# Altium project MotorController.PrjPcb (part 1 of 2)
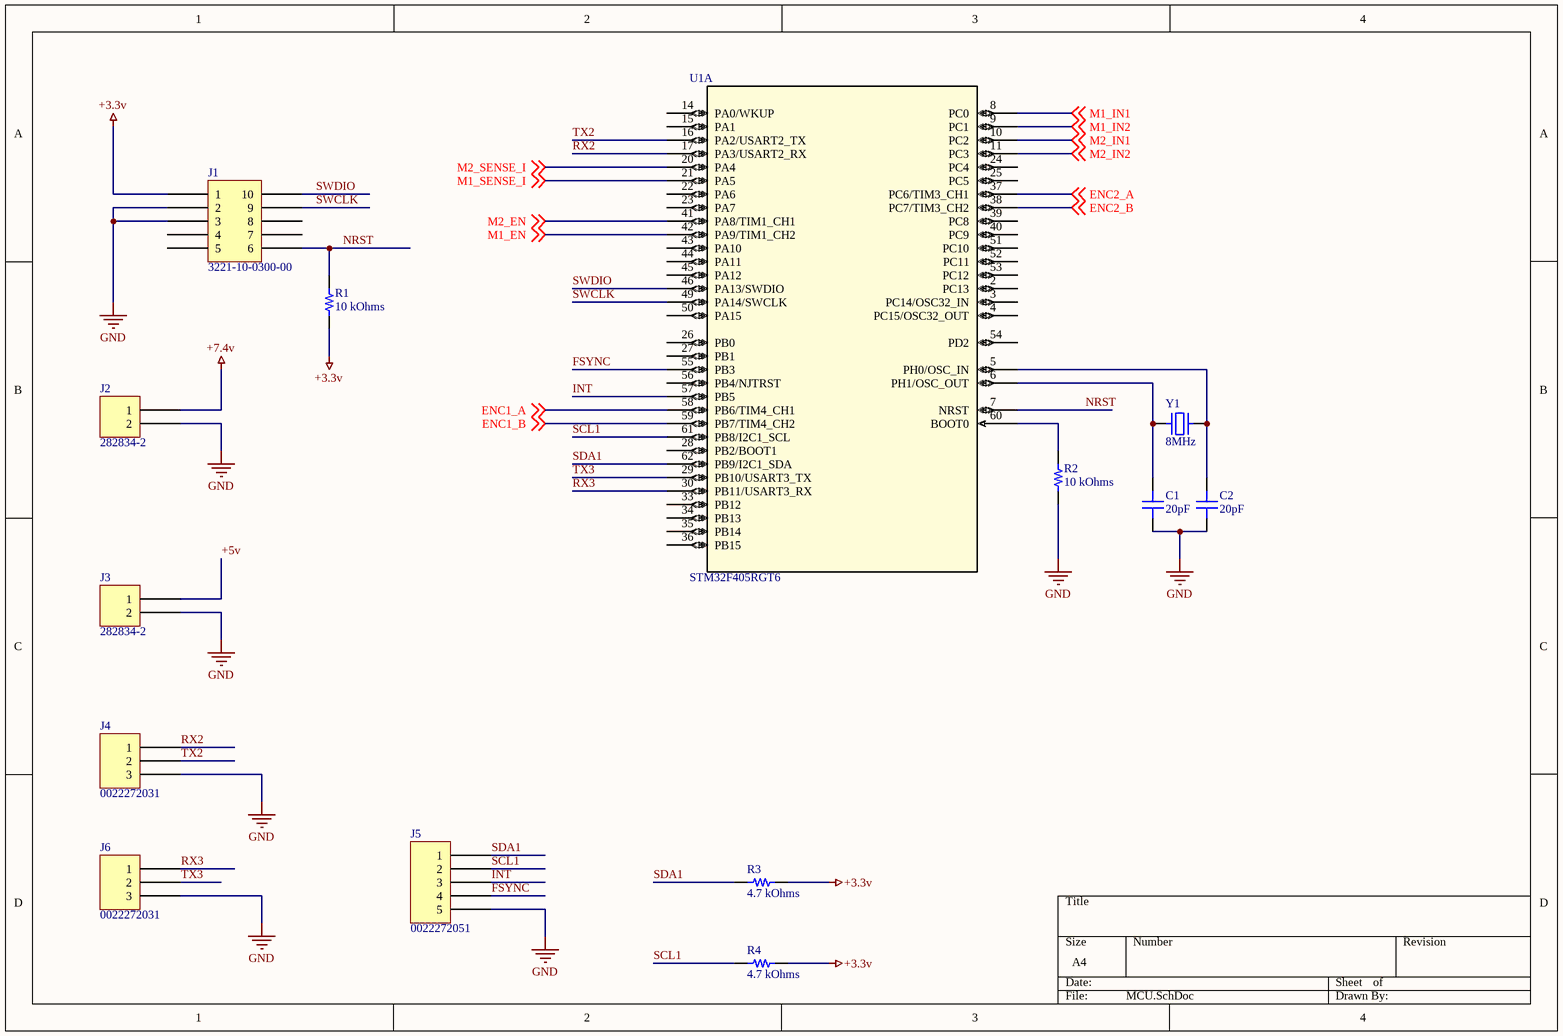
[diagram p0: MCU.SchDoc]
4 sheets, 80 parts. Net scope: global (net labels, ports and power ports of the same name join across sheets).
Board file: PCB1.PcbDoc
Sheets:
  MCU.SchDoc
  Power_12v.SchDoc
  MotorControl.SchDoc
  Power_5v.SchDoc

## Sheet MCU.SchDoc
size A4

### Parts
C1  20pF  [CAP 0805_2012]
C2  20pF  [CAP 0805_2012]
J1  3221-10-0300-00  [CNC TECH 3221-10-0300-00]
J2  282834-2  [TE 282834-2]
J3  282834-2  [TE 282834-2]
J4  0022272031  [MOLEX KK 0022272031]
J5  0022272051  [MOLEX KK 0022272051]
J6  0022272031  [MOLEX KK 0022272031]
R1  10 kOhms  [RES 0805_2012]
R2  10 kOhms  [RES 0805_2012]
R3  4.7 kOhms  [RES 0805_2012]
R4  4.7 kOhms  [RES 0805_2012]
U1  STM32F405RGT6  [LQFP64-10x10mm]  (part A of 2)
Y1  8MHz  [NDK NX5032GA]

### Nets
+3.3v: J1.1 R1.2 R3.2 R4.2
+5v: J3.1
+7.4v: J2.1
GND: C1.1 C2.1 J1.2 J1.3 J2.2 J3.2 J4.3 J5.5 J6.3 R2.1
ENC1_A: U1.58(PB6/TIM4_CH1) ; off-sheet ENC1_A
ENC1_B: U1.59(PB7/TIM4_CH2) ; off-sheet ENC1_B
ENC2_A: U1.37(PC6/TIM3_CH1) ; off-sheet ENC2_A
ENC2_B: U1.38(PC7/TIM3_CH2) ; off-sheet ENC2_B
FSYNC: J5.4 U1.55(PB3)
INT: J5.3 U1.57(PB5)
M1_EN: U1.42(PA9/TIM1_CH2) ; off-sheet M1_EN
M1_IN1: U1.8(PC0) ; off-sheet M1_IN1
M1_IN2: U1.9(PC1) ; off-sheet M1_IN2
M1_SENSE_I: U1.21(PA5) ; off-sheet M1_SENSE_I
M2_EN: U1.41(PA8/TIM1_CH1) ; off-sheet M2_EN
M2_IN1: U1.10(PC2) ; off-sheet M2_IN1
M2_IN2: U1.11(PC3) ; off-sheet M2_IN2
M2_SENSE_I: U1.20(PA4) ; off-sheet M2_SENSE_I
NRST: J1.6 R1.1 U1.7(NRST)
RX2: J4.1 U1.17(PA3/USART2_RX)
RX3: J6.1 U1.30(PB11/USART3_RX)
SCL1: J5.2 R4.1 U1.61(PB8/I2C1_SCL)
SDA1: J5.1 R3.1 U1.62(PB9/I2C1_SDA)
SWCLK: J1.9 U1.49(PA14/SWCLK)
SWDIO: J1.10 U1.46(PA13/SWDIO)
TX2: J4.2 U1.16(PA2/USART2_TX)
TX3: J6.2 U1.29(PB10/USART3_TX)
NetC1_2: C1.2 U1.6(PH1/OSC_OUT) Y1.1
NetC2_2: C2.2 U1.5(PH0/OSC_IN) Y1.2
NetR2_2: R2.2 U1.60(BOOT0)

Not connected (* = marked no-connect by the designer): J1 4 5 7 8; U1 2(PC13) 3(PC14/OSC32_IN) 4(PC15/OSC32_OUT) 14(PA0/WKUP) 15(PA1) 22(PA6) 23(PA7) 24(PC4) 25(PC5) 26(PB0) 27(PB1) 28(PB2/BOOT1) 33(PB12) 34(PB13) 35(PB14) 36(PB15) 39(PC8) 40(PC9) 43(PA10) 44(PA11) 45(PA12) 50(PA15) 51(PC10) 52(PC11) 53(PC12) 54(PD2) 56(PB4/NJTRST)

### Library data of the parts
C1 C2 = C0805C200J4GAC7800: CAP CER 20PF 16V C0G/NP0 0805; Manufacturer: KEMET; Temperature Coefficient: C0G, NP0; Tolerance: ±5%; Part Number: C0805C200J4GAC7800; Value: 20pF; Applications: General Purpose; Capacitance: 20pF; ComponentLink1Description: Datasheet; ComponentLink1URL: https://api.kemet.com/component-edge/download/datasheet/C0805C200J4GAC7800.pdf; ComponentLink2Description: DigiKey Link; ComponentLink2URL: http://digikey.com/product-detail/en/kemet/C0805C200J4GAC7800/399-9987-1-ND/3736986; Device Package: 0805 (2012 Metric); Features: Low ESL; LastUpdated: 9/2/2020 1:04:36 AM; Lifecycle Status: Active; Minimum Order: 1; Mounting Type: Surface Mount, MLCC; Operating Temperature: -55°C ~ 125°C; Package / Case: 0805 (2012 Metric); Packaging: TapeAndReel; PartId: 5865; Part Status: Active; Price: 0.06; Series: SMD Comm C0G; Size / Dimension: 0.079" L x 0.049" W (2.00mm x 1.25mm); Supplier 1: DigiKey; Supplier Part Number 1: 399-9987-1-ND; Thickness (Max): 0.035" (0.88mm); Voltage - Rated: 16V
J1 = 3221-10-0300-00: CONN HEADER SMD 10POS 1.27MM; Manufacturer: CNC Tech; Current Rating (Amps): 1A; Material Flammability Rating: UL94 V-0; Number of Positions: 10; Number of Positions Loaded: All; Pitch - Mating: 0.050" (1.27mm); Shrouding: Shrouded - 4 Wall; Style: Board to Cable/Wire; Part Number: 3221-10-0300-00; ComponentLink1Description: Datasheet; ComponentLink1URL: http://cnctech.us/idcmatching2.pdf; ComponentLink2Description: DigiKey Link; ComponentLink2URL: http://digikey.com/product-detail/en/cnc-tech/3221-10-0300-00/1175-1735-ND/4878946; Connector Type: Header; Contact Finish - Mating: Gold; Contact Finish - Post: Gold; Contact Finish Thickness - Mating: Flash; Contact Material: Brass; Contact Shape: Square; Contact Type: Male Pin; Fastening Type: Push-Pull; Features: Keying Slot; Insulation Height: 0.213" (5.40mm); Insulation Material: Polyamide (PA6T), Nylon 6T; LastUpdated: 1/13/2020 12:09:21 AM; Lifecycle Status: Active; Minimum Order: 1; Mounting Type: Surface Mount; Number of Rows: 2; Operating Temperature: -40°C ~ 105°C; Packaging: Tray; PartId: 109; Part Status: Active; Price: 0.73; Row Spacing - Mating: 0.050" (1.27mm); Series: -; Supplier 1: DigiKey; Supplier Part Number 1: 1175-1735-ND; Termination: Solder
J2 J3 = 282834-2: TERM BLK 2P SIDE ENT 2.54MM PCB; Manufacturer: TE Connectivity AMP Connectors; Current: 10A; Mating Orientation: Horizontal with Board; Number of Levels: 1; Pitch: 0.100" (2.54mm); Positions Per Level: 2; Voltage: 150V; Wire Gauge: 16-30 AWG; Wire Termination: Screw - Rising Cage Clamp; Part Number: 282834-2; Color: Green; ComponentLink1Description: Datasheet; ComponentLink1URL: https://www.te.com/commerce/DocumentDelivery/DDEController?Action=srchrtrv&DocNm=282834&DocType=Customer+Drawing&DocLang=English; ComponentLink2Description: DigiKey Link; ComponentLink2URL: http://digikey.com/product-detail/en/te-connectivity-amp-connectors/282834-2/A98333-ND/1150135; LastUpdated: 1/15/2020 4:15:38 AM; Lifecycle Status: Active; Minimum Order: 1; Mounting Type: Through Hole; Packaging: Bulk; Part Status: Active; Price: 0.88; Series: Buchanan; Supplier 1: DigiKey; Supplier Part Number 1: A98333-ND
J4 J6 = 0022272031: CONN HEADER VERT 3POS 2.54MM; Manufacturer: Molex; Contact Length - Mating: 0.295" (7.49mm); Contact Length - Post: 0.140" (3.56mm); Material Flammability Rating: UL94 V-0; Number of Positions: 3; Number of Positions Loaded: All; Overall Contact Length: 0.560" (14.22mm); Pitch - Mating: 0.100" (2.54mm); Shrouding: Shrouded - 1 Wall; Style: Board to Cable/Wire; Part Number: 0022272031; ComponentLink1Description: Datasheet; ComponentLink1URL: https://www.molex.com/pdm_docs/sd/022272031_sd.pdf; ComponentLink2Description: DigiKey Link; ComponentLink2URL: http://digikey.com/product-detail/en/molex/0022272031/WM4112-ND/1130578; Connector Type: Header; Contact Finish - Mating: Tin; Contact Finish - Post: Tin; Contact Finish Thickness - Mating: 100.0µin (2.54µm); Contact Material: Brass; Contact Shape: Square; Contact Type: Male Pin; Fastening Type: Friction Lock; Insulation Color: Natural; Insulation Height: 0.461" (11.70mm); Insulation Material: Polyamide (PA), Nylon; LastUpdated: 1/12/2020 11:51:54 PM; Lifecycle Status: Active; Minimum Order: 1; Mounting Type: Through Hole; Number of Rows: 1; Packaging: Bulk; PartId: 77; Part Status: Active; Price: 0.37; Series: KK 6410; Supplier 1: DigiKey; Supplier Part Number 1: WM4112-ND; Termination: Solder
J5 = 0022272051: CONN HEADER VERT 5POS 2.54MM; Manufacturer: Molex; Contact Length - Mating: 0.295" (7.49mm); Contact Length - Post: 0.140" (3.56mm); Material Flammability Rating: UL94 V-0; Number of Positions: 5; Number of Positions Loaded: All; Overall Contact Length: 0.560" (14.22mm); Pitch - Mating: 0.100" (2.54mm); Shrouding: Shrouded - 1 Wall; Style: Board to Cable/Wire; Part Number: 0022272051; ComponentLink1Description: Datasheet; ComponentLink1URL: https://www.molex.com/pdm_docs/sd/022272051_sd.pdf; ComponentLink2Description: DigiKey Link; ComponentLink2URL: http://digikey.com/product-detail/en/molex/0022272051/WM4114-ND/1130580; Connector Type: Header; Contact Finish - Mating: Tin; Contact Finish - Post: Tin; Contact Finish Thickness - Mating: 100.0µin (2.54µm); Contact Material: Brass; Contact Shape: Square; Contact Type: Male Pin; Fastening Type: Friction Lock; Insulation Color: Natural; Insulation Height: 0.461" (11.70mm); Insulation Material: Polyamide (PA), Nylon; LastUpdated: 1/12/2020 11:52:16 PM; Lifecycle Status: Active; Minimum Order: 1; Mounting Type: Through Hole; Number of Rows: 1; Packaging: Bulk; PartId: 79; Part Status: Active; Price: 0.46; Series: KK 6410; Supplier 1: DigiKey; Supplier Part Number 1: WM4114-ND; Termination: Solder
R1 = RMCS0805JT10K0: RES 10K OHM 5% 1/8W 0805; Manufacturer: Stackpole Electronics Inc; Power (Watts): 0.125W, 1/8W; Temperature Coefficient: ±100ppm/°C; Part Number: RMCS0805JT10K0; Value: 10 kOhms; ComponentLink1Description: Datasheet; ComponentLink1URL: https://www.seielect.com/catalog/sei-rmcs.pdf; ComponentLink2Description: DigiKey Link; ComponentLink2URL: http://digikey.com/product-detail/en/stackpole-electronics-inc/RMCS0805JT10K0/RMCS0805JT10K0CT-ND/9770325; Composition: Thick Film; Device Package: 0805 (2012 Metric); Features: Anti-Sulfur; Height - Seated (Max): 0.024" (0.60mm); LastUpdated: 9/2/2020 1:14:40 AM; Lifecycle Status: Active; Minimum Order: 1; Number of Terminations: 2; Operating Temperature: -55°C ~ 155°C; Package / Case: 0805 (2012 Metric); Packaging: TapeAndReel; PartId: 46907; Part Status: Active; Price: 0.01; Resistance: 10 kOhms; Series: RMCS; Size / Dimension: 0.079" L x 0.049" W (2.00mm x 1.25mm); Supplier 1: DigiKey; Supplier Part Number 1: RMCS0805JT10K0CT-ND; Supplier Device Package: 0805; Tolerance: ±5%
R2 = RC0805JR-0710KL: RES SMD 10K OHM 5% 1/8W 0805; Manufacturer: Yageo; Power (Watts): 0.125W, 1/8W; Temperature Coefficient: ±100ppm/°C; Part Number: RC0805JR-0710KL; Value: 10 kOhms; ComponentLink1Description: Datasheet; ComponentLink1URL: https://www.yageo.com/upload/media/product/productsearch/datasheet/rchip/PYu-RC_Group_51_RoHS_L_10.pdf; ComponentLink2Description: DigiKey Link; ComponentLink2URL: http://digikey.com/product-detail/en/yageo/RC0805JR-0710KL/311-10KARCT-ND/731188; Composition: Thick Film; Device Package: 0805 (2012 Metric); Features: Moisture Resistant; Height - Seated (Max): 0.024" (0.60mm); LastUpdated: 9/2/2020 1:15:00 AM; Lifecycle Status: Active; Minimum Order: 1; Number of Terminations: 2; Operating Temperature: -55°C ~ 155°C; Package / Case: 0805 (2012 Metric); Packaging: CutTape; PartId: 38737; Part Status: Active; Price: 0.10; Resistance: 10 kOhms; Series: RC; Size / Dimension: 0.079" L x 0.049" W (2.00mm x 1.25mm); Supplier 1: DigiKey; Supplier Part Number 1: 311-10KARCT-ND; Supplier Device Package: 0805; Tolerance: ±5%
R3 R4 = CRCW08054K70JNTA: RES SMD 4.7K OHM 5% 1/8W 0805; Manufacturer: Vishay Dale; Power (Watts): 0.125W, 1/8W; Temperature Coefficient: ±200ppm/°C; Part Number: CRCW08054K70JNTA; Value: 4.7 kOhms; ComponentLink1Description: Datasheet; ComponentLink1URL: http://www.vishay.com/docs/20008/dcrcw.pdf; ComponentLink2Description: DigiKey Link; ComponentLink2URL: http://digikey.com/product-detail/en/vishay-dale/CRCW08054K70JNTA/541-3029-1-ND/6073672; Composition: Thick Film; Device Package: 0805 (2012 Metric); Features: Automotive AEC-Q200; Height - Seated (Max): 0.020" (0.50mm); LastUpdated: 9/2/2020 1:15:17 AM; Lifecycle Status: Active; Minimum Order: 1; Number of Terminations: 2; Operating Temperature: -55°C ~ 155°C; Package / Case: 0805 (2012 Metric); Packaging: TapeAndReel; PartId: 30842; Part Status: Active; Price: 0.01; Ratings: AEC-Q200; Resistance: 4.7 kOhms; Series: CRCW; Size / Dimension: 0.079" L x 0.049" W (2.00mm x 1.25mm); Supplier 1: DigiKey; Supplier Part Number 1: 541-3029-1-ND; Supplier Device Package: 0805; Tolerance: ±5%
U1 = STM32F405RGT6: No Description Available; Vendor: STMicroelectronics; Built_By: EMA_UL_Team; SourceLibrary: Updates_to_database_2020-10-19; Manufacturer_Part_Number: STM32F405RGT6; Copyright: Copyright (C) 2018 Accelerated Designs. All rights reserved; RefDes: RefDes; Type: DEV
Y1 = NX5032GA-8MHZ-EXS00A-CG07039: CRYSTAL 8MHZ 18PF SMD; Manufacturer: NDK America, Inc.; ESR (Equivalent Series Resistance): 300 Ohms; Frequency Stability: ±30ppm; Frequency Tolerance: ±20ppm; Operating Mode: Fundamental; Part Number: NX5032GA-8MHZ-EXS00A-CG07039; ComponentLink1Description: Datasheet; ComponentLink1URL: //media.digikey.com/pdf/Data%20Sheets/NDK%20PDFs/NX5032GA-8MHz-EXS00A-CG07039.pdf; ComponentLink2Description: DigiKey Link; ComponentLink2URL: http://digikey.com/product-detail/en/ndk-america-inc/NX5032GA-8MHZ-EXS00A-CG07039/644-1318-1-ND/8275436; Frequency: 8MHz; Height - Seated (Max): 0.059" (1.50mm); LastUpdated: 02.09.2020 1:22:00; Lifecycle Status: Active; Load Capacitance: 18pF; Minimum Order: 1; Mounting Type: Surface Mount; Operating Temperature: -40°C ~ 85°C; Package / Case: 2-SMD, No Lead; Packaging: TapeAndReel; PartId: 609; Part Status: Active; Price: 0.37; Series: NX5032GA; Size / Dimension: 0.197" L x 0.126" W (5.00mm x 3.20mm); Supplier 1: DigiKey; Supplier Part Number 1: 644-1318-1-ND; Type: MHz Crystal; Value: 8MHz

## Sheet Power_12v.SchDoc
size A
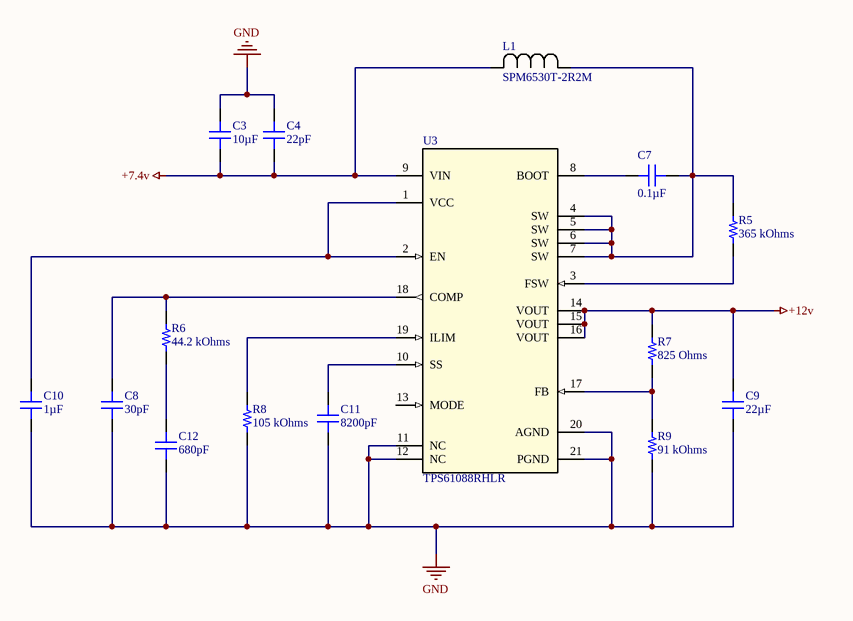
[diagram p1: Power_12v.SchDoc]

### Parts
C3  10µF  [CAP 1210_3225 - 2.8MM]
C4  22pF  [CAP 0603_1608]
C7  0.1µF  [CAP 0603_1608]
C8  value 30pF  [CAP 0603_1608]  (hidden comment: 22pF)
C9  22µF  [CAP 1210_3225 - 2.8MM]
C10  1µF  [CAP 0603_1608]
C11  value 8200pF  [CAP 0603_1608]  (hidden comment: 1µF)
C12  value 680pF  [CAP 0603_1608]  (hidden comment: 470pF)
L1  SPM6530T-2R2M  [IND_SPM6530_TDK]
R5  value 365 kOhms  [RES 0603_1608]  (hidden comment: 267 kOhms)
R6  value 44.2 kOhms  [RES 0603_1608]  (hidden comment: 36.5 kOhms)
R7  value 825 Ohms  [RES 0603_1608]  (hidden comment: 267 kOhms)
R8  105 kOhms  [RES 0603_1608]
R9  value 91 kOhms  [RES 0805_2012]  (hidden comment: 392 kOhms)
U3  TPS61088RHLR  [RHL0020A]

### Nets
+7.4v: C3.1 C4.1 L1.2 U3.9(VIN)
+12v: C9.2 R7.2 U3.14(VOUT) U3.15(VOUT) U3.16(VOUT)
GND: C3.2 C4.2 C8.1 C9.1 C10.1 C11.1 C12.1 R8.1 R9.2 U3.11(NC) U3.12(NC) U3.20(AGND) U3.21(PGND)
NetC7_1: C7.1 U3.8(BOOT)
NetC7_2: C7.2 L1.1 R5.2 U3.4(SW) U3.5(SW) U3.6(SW) U3.7(SW)
NetC8_2: C8.2 R6.2 U3.18(COMP)
NetC10_2: C10.2 U3.1(VCC) U3.2(EN)
NetC11_2: C11.2 U3.10(SS)
NetC12_2: C12.2 R6.1
NetR5_1: R5.1 U3.3(FSW)
NetR7_1: R7.1 R9.1 U3.17(FB)
NetR8_2: R8.2 U3.19(ILIM)

Not connected (* = marked no-connect by the designer): U3 13(MODE)

### Library data of the parts
C3 = GCJ32EC71H106KA01L: CAP CER 10UF 50V X7S 1210; Manufacturer: Murata Electronics; Tolerance: ±10%; Part Number: GCJ32EC71H106KA01L; Value: 10µF; Applications: Automotive, Boardflex Sensitive; Capacitance: 10µF; ComponentLink1Description: Datasheet; ComponentLink1URL: https://search.murata.co.jp/Ceramy/image/img/A01X/G101/ENG/GCJ32EC71H106KA01-01.pdf; ComponentLink2Description: DigiKey Link; ComponentLink2URL: http://digikey.com/product-detail/en/murata-electronics/GCJ32EC71H106KA01L/490-14418-1-ND/6606879; Device Package: 1210 (3225 Metric); Features: Soft Termination; LastUpdated: 9/2/2020 1:10:53 AM; Lifecycle Status: Active; Minimum Order: 1; Mounting Type: Surface Mount, MLCC; Operating Temperature: -55°C ~ 125°C; Package / Case: 1210 (3225 Metric); Packaging: TapeAndReel; PartId: 23622; Part Status: Active; Price: 0.53; Ratings: AEC-Q200; Series: GCJ; Size / Dimension: 0.126" L x 0.098" W (3.20mm x 2.50mm); Supplier 1: DigiKey; Supplier Part Number 1: 490-14418-1-ND; Temperature Coefficient: X7S; Thickness (Max): 0.110" (2.80mm); Voltage - Rated: 50V
C4 = 06033A220KAT2A: CAP CER 22PF 25V C0G/NP0 0603; Manufacturer: AVX Corporation; Temperature Coefficient: C0G, NP0; Tolerance: ±10%; Part Number: 06033A220KAT2A; Value: 22pF; Applications: General Purpose; Capacitance: 22pF; ComponentLink1Description: Datasheet; ComponentLink1URL: http://datasheets.avx.com/C0GNP0-Dielectric.pdf; ComponentLink2Description: DigiKey Link; ComponentLink2URL: http://digikey.com/product-detail/en/avx-corporation/06033A220KAT2A/478-11803-1-ND/8573439; Device Package: 0603 (1608 Metric); LastUpdated: 9/2/2020 1:03:34 AM; Lifecycle Status: Active; Minimum Order: 1; Mounting Type: Surface Mount, MLCC; Operating Temperature: -55°C ~ 125°C; Package / Case: 0603 (1608 Metric); Packaging: TapeAndReel; PartId: 3017; Part Status: Active; Price: 0.04; Series: -; Size / Dimension: 0.063" L x 0.032" W (1.60mm x 0.81mm); Supplier 1: DigiKey; Supplier Part Number 1: 478-11803-1-ND; Thickness (Max): 0.035" (0.90mm); Voltage - Rated: 25V
C7 = 0603YC104JAT4A: CAP CER 0.1UF 16V X7R 0603; Manufacturer: AVX Corporation; Tolerance: ±5%; Part Number: 0603YC104JAT4A; Value: 0.1µF; Applications: General Purpose; Capacitance: 0.1µF; ComponentLink1Description: Datasheet; ComponentLink1URL: http://datasheets.avx.com/X7RDielectric.pdf; ComponentLink2Description: DigiKey Link; ComponentLink2URL: http://digikey.com/product-detail/en/avx-corporation/0603YC104JAT4A/478-7621-1-ND/7536239; Device Package: 0603 (1608 Metric); LastUpdated: 9/2/2020 1:03:19 AM; Lifecycle Status: Active; Minimum Order: 1; Mounting Type: Surface Mount, MLCC; Operating Temperature: -55°C ~ 125°C; Package / Case: 0603 (1608 Metric); Packaging: TapeAndReel; PartId: 11638; Part Status: Active; Price: 0.03; Series: -; Size / Dimension: 0.063" L x 0.032" W (1.60mm x 0.81mm); Supplier 1: DigiKey; Supplier Part Number 1: 478-7621-1-ND; Temperature Coefficient: X7R; Thickness (Max): 0.035" (0.90mm); Voltage - Rated: 16V
C8 = C0805C300J5GACTU: CAP CER 30PF 50V C0G/NP0 0805; Manufacturer: KEMET; Temperature Coefficient: C0G, NP0; Tolerance: ±5%; Part Number: C0805C300J5GACTU; Applications: General Purpose; Capacitance: 30pF; ComponentLink1Description: Datasheet; ComponentLink1URL: https://api.kemet.com/component-edge/download/datasheet/C0805C300J5GACTU.pdf; ComponentLink2Description: DigiKey Link; ComponentLink2URL: http://digikey.com/product-detail/en/kemet/C0805C300J5GACTU/399-9219-1-ND/3522737; Device Package: 0805 (2012 Metric); Features: Low ESL; LastUpdated: 9/2/2020 1:04:20 AM; Lifecycle Status: Active; Minimum Order: 1; Mounting Type: Surface Mount, MLCC; Operating Temperature: -55°C ~ 125°C; Package / Case: 0805 (2012 Metric); Packaging: TapeAndReel; PartId: 14047; Part Status: Active; Price: 0.06; Series: SMD Comm C0G; Size / Dimension: 0.079" L x 0.049" W (2.00mm x 1.25mm); Supplier 1: DigiKey; Supplier Part Number 1: 399-9219-1-ND; Thickness (Max): 0.035" (0.88mm); Voltage - Rated: 50V
C9 = GRM32ER71E226ME15K: CAP CER 22UF 25V X7R 1210; Manufacturer: Murata Electronics; Tolerance: ±20%; Part Number: GRM32ER71E226ME15K; Value: 22µF; Applications: General Purpose; Capacitance: 22µF; ComponentLink1Description: Datasheet; ComponentLink1URL: https://search.murata.co.jp/Ceramy/image/img/A01X/G101/ENG/GRM32ER71E226ME15-01.pdf; ComponentLink2Description: DigiKey Link; ComponentLink2URL: http://digikey.com/product-detail/en/murata-electronics/GRM32ER71E226ME15K/490-14682-1-ND/6606288; Device Package: 1210 (3225 Metric); LastUpdated: 9/2/2020 1:10:50 AM; Lifecycle Status: Active; Minimum Order: 1; Mounting Type: Surface Mount, MLCC; Operating Temperature: -55°C ~ 125°C; Package / Case: 1210 (3225 Metric); Packaging: TapeAndReel; PartId: 24019; Part Status: Active; Price: 0.35; Series: GRM; Size / Dimension: 0.126" L x 0.098" W (3.20mm x 2.50mm); Supplier 1: DigiKey; Supplier Part Number 1: 490-14682-1-ND; Temperature Coefficient: X7R; Thickness (Max): 0.106" (2.70mm); Voltage - Rated: 25V
C10 = C0603C105K4PACTU: CAP CER 1UF 16V X5R 0603; Manufacturer: KEMET; Tolerance: ±10%; Part Number: C0603C105K4PACTU; Value: 1µF; Applications: General Purpose; Capacitance: 1µF; ComponentLink1Description: Datasheet; ComponentLink1URL: https://api.kemet.com/component-edge/download/datasheet/C0603C105K4PACTU.pdf; ComponentLink2Description: DigiKey Link; ComponentLink2URL: http://digikey.com/product-detail/en/kemet/C0603C105K4PACTU/399-5090-1-ND/1465624; Device Package: 0603 (1608 Metric); LastUpdated: 9/2/2020 1:03:33 AM; Lifecycle Status: Active; Minimum Order: 1; Mounting Type: Surface Mount, MLCC; Operating Temperature: -55°C ~ 85°C; Package / Case: 0603 (1608 Metric); Packaging: TapeAndReel; PartId: 3768; Part Status: Active; Price: 0.02; Series: SMD Comm X5R; Size / Dimension: 0.063" L x 0.031" W (1.60mm x 0.80mm); Supplier 1: DigiKey; Supplier Part Number 1: 399-5090-1-ND; Temperature Coefficient: X5R; Thickness (Max): 0.035" (0.90mm); Voltage - Rated: 16V
C11 = CDR31BX822AKUS7185: CAP CER 8200PF 50V BX 0805; Manufacturer: KEMET; Tolerance: ±10%; Part Number: CDR31BX822AKUS7185; Applications: High Reliability; Capacitance: 8200pF; ComponentLink1Description: Datasheet; ComponentLink1URL: https://content.kemet.com/datasheets/F3102_MIL-PRF-55681.pdf; ComponentLink2Description: DigiKey Link; ComponentLink2URL: http://digikey.com/product-detail/en/kemet/CDR31BX822AKUS7185/1001-2399-1-ND/3738615; Device Package: 0805 (2012 Metric); Failure Rate: S (0.001%); LastUpdated: 9/2/2020 1:04:33 AM; Lifecycle Status: Active; Minimum Order: 1; Mounting Type: Surface Mount, MLCC; Operating Temperature: -55°C ~ 125°C; Package / Case: 0805 (2012 Metric); Packaging: TapeAndReel; PartId: 7255; Part Status: Active; Price: 0.86; Series: Military, MIL-PRF-55681, CDR31; Size / Dimension: 0.079" L x 0.049" W (2.00mm x 1.25mm); Supplier 1: DigiKey; Supplier Part Number 1: 1001-2399-1-ND; Temperature Coefficient: BX; Thickness (Max): 0.051" (1.30mm); Voltage - Rated: 50V
C12 = CC0805JRNPO9BN681: CAP CER 680PF 50V C0G/NPO 0805; Manufacturer: Yageo; Temperature Coefficient: C0G, NP0; Tolerance: ±5%; Part Number: CC0805JRNPO9BN681; Applications: General Purpose; Capacitance: 680pF; ComponentLink1Description: Datasheet; ComponentLink1URL: https://www.yageo.com/upload/media/product/productsearch/datasheet/mlcc/UPY-GP_NP0_16V-to-50V_17.pdf; ComponentLink2Description: DigiKey Link; ComponentLink2URL: http://digikey.com/product-detail/en/yageo/CC0805JRNPO9BN681/311-1121-1-ND/303031; Device Package: 0805 (2012 Metric); Features: High Voltage; LastUpdated: 9/2/2020 1:04:42 AM; Lifecycle Status: Active; Minimum Order: 1; Mounting Type: Surface Mount, MLCC; Operating Temperature: -55°C ~ 125°C; Package / Case: 0805 (2012 Metric); Packaging: TapeAndReel; PartId: 2491; Part Status: Active; Price: 0.02; Series: CC; Size / Dimension: 0.079" L x 0.049" W (2.00mm x 1.25mm); Supplier 1: DigiKey; Supplier Part Number 1: 311-1121-1-ND; Thickness (Max): 0.024" (0.60mm); Voltage - Rated: 50V
L1 = SPM6530T-2R2M: No Description Available; Vendor: TDK; Built_By: EMA_UL_Team; SourceLibrary: TDK_2015_05_22; Manufacturer_Part_Number: SPM6530T-2R2M; Copyright: Copyright (C) 2018 Accelerated Designs. All rights reserved
R5 = RC0805FR-07365KL: RES SMD 365K OHM 1% 1/8W 0805; Manufacturer: Yageo; Power (Watts): 0.125W, 1/8W; Temperature Coefficient: ±100ppm/°C; Part Number: RC0805FR-07365KL; ComponentLink1Description: Datasheet; ComponentLink1URL: https://www.yageo.com/upload/media/product/productsearch/datasheet/rchip/PYu-RC_Group_51_RoHS_L_10.pdf; ComponentLink2Description: DigiKey Link; ComponentLink2URL: http://digikey.com/product-detail/en/yageo/RC0805FR-07365KL/311-365KCRCT-ND/730836; Composition: Thick Film; Device Package: 0805 (2012 Metric); Features: Moisture Resistant; Height - Seated (Max): 0.024" (0.60mm); LastUpdated: 9/2/2020 1:14:46 AM; Lifecycle Status: Active; Minimum Order: 1; Number of Terminations: 2; Operating Temperature: -55°C ~ 155°C; Package / Case: 0805 (2012 Metric); Packaging: CutTape; PartId: 45039; Part Status: Active; Price: 0.10; Resistance: 365 kOhms; Series: RC; Size / Dimension: 0.079" L x 0.049" W (2.00mm x 1.25mm); Supplier 1: DigiKey; Supplier Part Number 1: 311-365KCRCT-ND; Supplier Device Package: 0805; Tolerance: ±1%
R6 = KTR10EZPF4422: RES SMD 44.2K OHM 1% 1/8W 0805; Manufacturer: Rohm Semiconductor; Power (Watts): 0.125W, 1/8W; Temperature Coefficient: ±100ppm/°C; Part Number: KTR10EZPF4422; ComponentLink1Description: Datasheet; ComponentLink1URL: https://www.rohm.com/datasheet/KTR03EZPF/ktr-e; ComponentLink2Description: DigiKey Link; ComponentLink2URL: http://digikey.com/product-detail/en/rohm-semiconductor/KTR10EZPF4422/RHM44.2KAHCT-ND/4054582; Composition: Thick Film; Device Package: 0805 (2012 Metric); Features: Automotive AEC-Q200, High Voltage; Height - Seated (Max): 0.026" (0.65mm); LastUpdated: 9/2/2020 1:15:21 AM; Lifecycle Status: Active; Minimum Order: 1; Number of Terminations: 2; Operating Temperature: -55°C ~ 155°C; Package / Case: 0805 (2012 Metric); Packaging: TapeAndReel; PartId: 29064; Part Status: Active; Price: 0.02; Ratings: AEC-Q200; Resistance: 44.2 kOhms; Series: KTR; Size / Dimension: 0.079" L x 0.049" W (2.00mm x 1.25mm); Supplier 1: DigiKey; Supplier Part Number 1: RHM44.2KAHCT-ND; Supplier Device Package: 0805; Tolerance: ±1%
R7 = RMCF0805FT825R: RES 825 OHM 1% 1/8W 0805; Manufacturer: Stackpole Electronics Inc; Power (Watts): 0.125W, 1/8W; Temperature Coefficient: ±100ppm/°C; Part Number: RMCF0805FT825R; ComponentLink1Description: Datasheet; ComponentLink1URL: https://www.seielect.com/catalog/sei-rmcf_rmcp.pdf; ComponentLink2Description: DigiKey Link; ComponentLink2URL: http://digikey.com/product-detail/en/stackpole-electronics-inc/RMCF0805FT825R/RMCF0805FT825RCT-ND/1942368; Composition: Thick Film; Device Package: 0805 (2012 Metric); Features: Automotive AEC-Q200; Height - Seated (Max): 0.026" (0.65mm); LastUpdated: 9/2/2020 1:14:59 AM; Lifecycle Status: Active; Minimum Order: 1; Number of Terminations: 2; Operating Temperature: -55°C ~ 155°C; Package / Case: 0805 (2012 Metric); Packaging: CutTape; PartId: 38939; Part Status: Active; Price: 0.10; Ratings: AEC-Q200; Resistance: 825 Ohms; Series: RMCF; Size / Dimension: 0.079" L x 0.049" W (2.00mm x 1.25mm); Supplier 1: DigiKey; Supplier Part Number 1: RMCF0805FT825RCT-ND; Supplier Device Package: 0805; Tolerance: ±1%
R8 = RC0603FR-07105KL: RES SMD 105K OHM 1% 1/10W 0603; Manufacturer: Yageo; Power (Watts): 0.1W, 1/10W; Temperature Coefficient: ±100ppm/°C; Part Number: RC0603FR-07105KL; Value: 105 kOhms; ComponentLink1Description: Datasheet; ComponentLink1URL: https://www.yageo.com/upload/media/product/productsearch/datasheet/rchip/PYu-RC_Group_51_RoHS_L_10.pdf; ComponentLink2Description: DigiKey Link; ComponentLink2URL: http://digikey.com/product-detail/en/yageo/RC0603FR-07105KL/311-105KHRCT-ND/729840; Composition: Thick Film; Device Package: 0603 (1608 Metric); Features: Moisture Resistant; Height - Seated (Max): 0.022" (0.55mm); LastUpdated: 9/2/2020 1:10:19 AM; Lifecycle Status: Active; Minimum Order: 1; Number of Terminations: 2; Operating Temperature: -55°C ~ 155°C; Package / Case: 0603 (1608 Metric); Packaging: CutTape; PartId: 7511; Part Status: Active; Price: 0.10; Resistance: 105 kOhms; Series: RC; Size / Dimension: 0.063" L x 0.031" W (1.60mm x 0.80mm); Supplier 1: DigiKey; Supplier Part Number 1: 311-105KHRCT-ND; Supplier Device Package: 0603; Tolerance: ±1%
R9 = CRCW080591K0JNEA: RES SMD 91K OHM 5% 1/8W 0805; Manufacturer: Vishay Dale; Power (Watts): 0.125W, 1/8W; Temperature Coefficient: ±200ppm/°C; Part Number: CRCW080591K0JNEA; ComponentLink1Description: Datasheet; ComponentLink1URL: http://www.vishay.com/docs/20035/dcrcwe3.pdf; ComponentLink2Description: DigiKey Link; ComponentLink2URL: http://digikey.com/product-detail/en/vishay-dale/CRCW080591K0JNEA/541-91KACT-ND/1180387; Composition: Thick Film; Device Package: 0805 (2012 Metric); Features: Automotive AEC-Q200; Height - Seated (Max): 0.020" (0.50mm); LastUpdated: 9/2/2020 1:14:34 AM; Lifecycle Status: Active; Minimum Order: 1; Number of Terminations: 2; Operating Temperature: -55°C ~ 155°C; Package / Case: 0805 (2012 Metric); Packaging: CutTape; PartId: 48020; Part Status: Active; Price: 0.10; Ratings: AEC-Q200; Resistance: 91 kOhms; Series: CRCW; Size / Dimension: 0.079" L x 0.049" W (2.00mm x 1.25mm); Supplier 1: DigiKey; Supplier Part Number 1: 541-91KACT-ND; Supplier Device Package: 0805; Tolerance: ±5%
U3 = TPS61088RHLR: No Description Available; Alternate_PartNumber: TPS61088RHLT; Manufacturer: Texas Instruments; CompType: IC; PIN_COUNT: 21; Application_BuildNumber: *; PartNumber: TPS61088RHLR; PackageReference: RHL0020A; MountType: SMT; RoHS: Y; RefDes: RefDes; Type: DEV; Value: Value; Copyright: Copyright (C) 2018 Accelerated Designs. All rights reserved

## Sheet MotorControl.SchDoc
size Letter
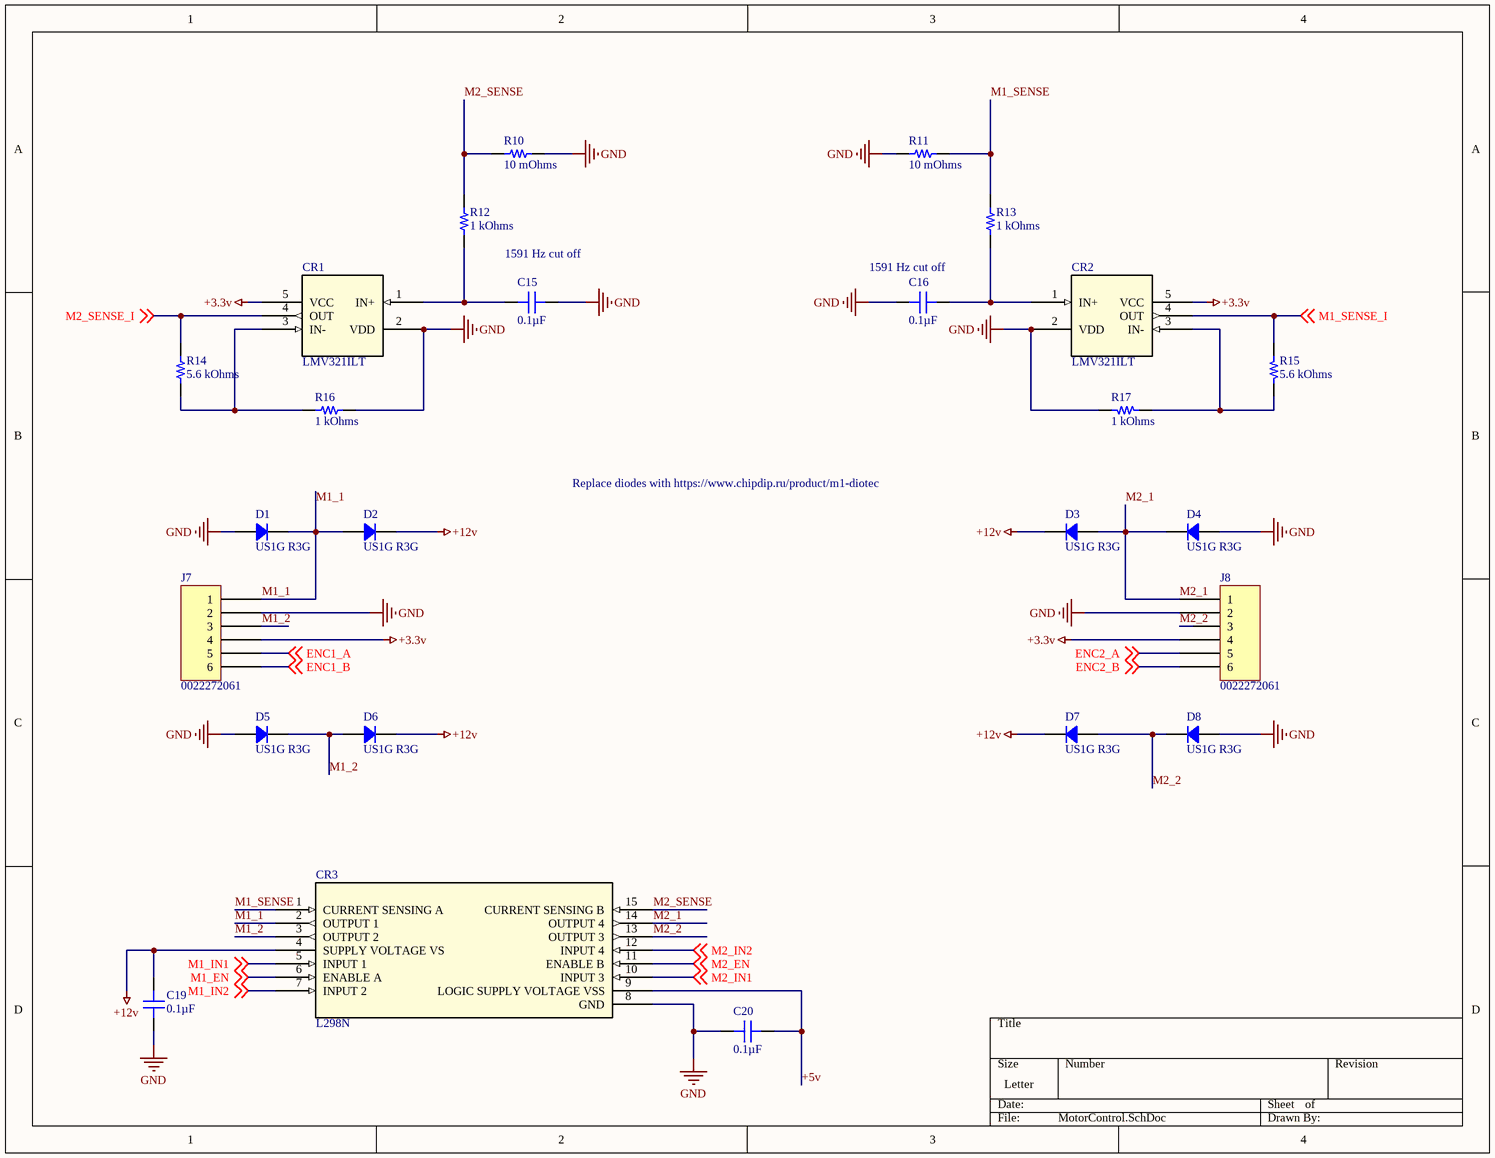
[diagram p2: MotorControl.SchDoc]

### Parts
C15  0.1µF  [CAP 0805_2012]
C16  0.1µF  [CAP 0805_2012]
C19  0.1µF  [CAP 0805_2012]
C20  0.1µF  [CAP 0805_2012]
CR1  LMV321ILT  [SOT23-5_STM]
CR2  LMV321ILT  [SOT23-5_STM]
CR3  L298N  [Multiwatt15_V_STM]
D1  US1G R3G  [DO214AC SMA]
D2  US1G R3G  [DO214AC SMA]
D3  US1G R3G  [DO214AC SMA]
D4  US1G R3G  [DO214AC SMA]
D5  US1G R3G  [DO214AC SMA]
D6  US1G R3G  [DO214AC SMA]
D7  US1G R3G  [DO214AC SMA]
D8  US1G R3G  [DO214AC SMA]
J7  0022272061  [MOLEX KK 0022272061]
J8  0022272061  [MOLEX KK 0022272061]
R10  10 mOhms  [RES 1206_3216]
R11  10 mOhms  [RES 1206_3216]
R12  1 kOhms  [RES 0805_2012]
R13  1 kOhms  [RES 0805_2012]
R14  5.6 kOhms  [RES 0805_2012]
R15  5.6 kOhms  [RES 0805_2012]
R16  1 kOhms  [RES 0805_2012]
R17  1 kOhms  [RES 0805_2012]

### Nets
+3.3v: CR1.5(VCC) CR2.5(VCC) J7.4 J8.4
+5v: C20.2 CR3.9(LOGIC_SUPPLY_VOLTAGE_VSS)
+12v: C19.2 CR3.4(SUPPLY_VOLTAGE_VS) D2.2 D3.2 D6.2 D7.2
GND: C15.2 C16.1 C19.1 C20.1 CR1.2(VDD) CR2.2(VDD) CR3.8(GND) D1.1 D4.1 D5.1 D8.1 J7.2 J8.2 R10.2 R11.1 R16.2 R17.2
ENC1_A: J7.5 ; off-sheet ENC1_A
ENC1_B: J7.6 ; off-sheet ENC1_B
ENC2_A: J8.5 ; off-sheet ENC2_A
ENC2_B: J8.6 ; off-sheet ENC2_B
M1_1: CR3.2(OUTPUT_1) D1.2 D2.1 J7.1
M1_2: CR3.3(OUTPUT_2) D5.2 D6.1 J7.3
M1_EN: CR3.6(ENABLE_A) ; off-sheet M1_EN
M1_IN1: CR3.5(INPUT_1) ; off-sheet M1_IN1
M1_IN2: CR3.7(INPUT_2) ; off-sheet M1_IN2
M1_SENSE: CR3.1(CURRENT_SENSING_A) R11.2 R13.2
M1_SENSE_I: CR2.4(OUT) R15.2 ; off-sheet M1_SENSE_I
M2_1: CR3.14(OUTPUT_4) D3.1 D4.2 J8.1
M2_2: CR3.13(OUTPUT_3) D7.1 D8.2 J8.3
M2_EN: CR3.11(ENABLE_B) ; off-sheet M2_EN
M2_IN1: CR3.10(INPUT_3) ; off-sheet M2_IN1
M2_IN2: CR3.12(INPUT_4) ; off-sheet M2_IN2
M2_SENSE: CR3.15(CURRENT_SENSING_B) R10.1 R12.2
M2_SENSE_I: CR1.4(OUT) R14.2 ; off-sheet M2_SENSE_I
NetC15_1: C15.1 CR1.1(IN+) R12.1
NetC16_2: C16.2 CR2.1(IN+) R13.1
NetCR1_3: CR1.3(IN-) R14.1 R16.1
NetCR2_3: CR2.3(IN-) R15.1 R17.1

### Notes on the sheet
- 1591 Hz cut off
- Replace diodes with https://www.chipdip.ru/product/m1-diotec

### Library data of the parts
C15 C16 = VJ0805V104ZXJCW1BC: CAP CER 0.1UF 16V Y5V 0805; Manufacturer: Vishay Vitramon; Temperature Coefficient: Y5V (F); Tolerance: -20%, +80%; Part Number: VJ0805V104ZXJCW1BC; Value: 0.1µF; Applications: General Purpose; Capacitance: 0.1µF; ComponentLink1Description: Datasheet; ComponentLink1URL: https://www.vishay.com/docs/28548/vjw1bcbascomseries.pdf; ComponentLink2Description: DigiKey Link; ComponentLink2URL: http://digikey.com/product-detail/en/vishay-vitramon/VJ0805V104ZXJCW1BC/720-1731-1-ND/8324151; Device Package: 0805 (2012 Metric); LastUpdated: 9/2/2020 1:04:40 AM; Lifecycle Status: Active; Minimum Order: 1; Mounting Type: Surface Mount, MLCC; Operating Temperature: -25°C ~ 85°C; Package / Case: 0805 (2012 Metric); Packaging: TapeAndReel; PartId: 3674; Part Status: Active; Price: 0.04; Series: VJ; Size / Dimension: 0.079" L x 0.049" W (2.00mm x 1.25mm); Supplier 1: DigiKey; Supplier Part Number 1: 720-1731-1-ND; Thickness (Max): 0.028" (0.70mm); Voltage - Rated: 16V
C19 C20 = CC0805MRX7R9BB104: CAP CER 0.1UF 50V X7R 0805; Manufacturer: Yageo; Tolerance: ±20%; Part Number: CC0805MRX7R9BB104; Value: 0.1µF; Applications: General Purpose; Capacitance: 0.1µF; ComponentLink1Description: Datasheet; ComponentLink1URL: https://www.yageo.com/upload/media/product/productsearch/datasheet/mlcc/UPY-GPHC_X7R_6.3V-to-50V_18.pdf; ComponentLink2Description: DigiKey Link; ComponentLink2URL: http://digikey.com/product-detail/en/yageo/CC0805MRX7R9BB104/311-4351-1-ND/8025440; Device Package: 0805 (2012 Metric); LastUpdated: 9/2/2020 1:04:42 AM; Lifecycle Status: Active; Minimum Order: 1; Mounting Type: Surface Mount, MLCC; Operating Temperature: -55°C ~ 125°C; Package / Case: 0805 (2012 Metric); Packaging: TapeAndReel; PartId: 2475; Part Status: Active; Price: 0.02; Series: CC; Size / Dimension: 0.079" L x 0.049" W (2.00mm x 1.25mm); Supplier 1: DigiKey; Supplier Part Number 1: 311-4351-1-ND; Temperature Coefficient: X7R; Thickness (Max): 0.037" (0.95mm); Voltage - Rated: 50V
CR1 CR2 = LMV321ILT: No Description Available; SourceLibrary: Update_to_database_2020-12-04; Built_By: EMA_UL_Team; Vendor: STMicroelectronics; Type: DEV; Manufacturer_Part_Number: LMV321ILT; Copyright: Copyright (C) 2018 Accelerated Designs. All rights reserved; RefDes: RefDes
CR3 = L298N: No Description Available; SourceLibrary: Updates_to_database_2020-11-02; Built_By: EMA_UL_Team; Vendor: STMicroelectronics; Type: DEV; Manufacturer_Part_Number: L298N; Copyright: Copyright (C) 2018 Accelerated Designs. All rights reserved; RefDes: RefDes
D1-D8 = US1G R3G: DIODE GEN PURP 400V 1A DO214AC; Manufacturer: Taiwan Semiconductor Corporation; Capacitance @ Vr, F: 15pF @ 4V, 1MHz; Current - Reverse Leakage @ Vr: 5µA @ 400V; Diode Type: Standard; Reverse Recovery Time (trr): 50ns; Speed: Fast Recovery =< 500ns, > 200mA (Io); Voltage - Forward (Vf) (Max) @ If: 1V @ 1A; Part Number: US1G R3G; ComponentLink1Description: Datasheet; ComponentLink1URL: https://www.taiwansemi.com/products/datasheet/US1A%20SERIES_M15.pdf; ComponentLink2Description: DigiKey Link; ComponentLink2URL: http://digikey.com/product-detail/en/taiwan-semiconductor-corporation/US1G-R3G/US1GR3GCT-ND/7360843; Current - Average Rectified (Io): 1A; LastUpdated: 9/2/2020 1:19:02 AM; Lifecycle Status: Active; Minimum Order: 1; Mounting Type: Surface Mount; Operating Temperature - Junction: -55°C ~ 150°C; Package / Case: DO-214AC, SMA; Packaging: TapeAndReel; PartId: 930; Part Status: Active; Price: 0.09; Series: -; Supplier 1: DigiKey; Supplier Part Number 1: US1GR3GCT-ND; Supplier Device Package: DO-214AC (SMA); Voltage - DC Reverse (Vr) (Max): 400V
J7 J8 = 0022272061: CONN HEADER VERT 6POS 2.54MM; Manufacturer: Molex; Contact Length - Mating: 0.295" (7.49mm); Contact Length - Post: 0.140" (3.56mm); Material Flammability Rating: UL94 V-0; Number of Positions: 6; Number of Positions Loaded: All; Overall Contact Length: 0.560" (14.22mm); Pitch - Mating: 0.100" (2.54mm); Shrouding: Shrouded - 1 Wall; Style: Board to Cable/Wire; Part Number: 0022272061; ComponentLink1Description: Datasheet; ComponentLink1URL: https://www.molex.com/pdm_docs/sd/022272061_sd.pdf; ComponentLink2Description: DigiKey Link; ComponentLink2URL: http://digikey.com/product-detail/en/molex/0022272061/WM4115-ND/1130581; Connector Type: Header; Contact Finish - Mating: Tin; Contact Finish - Post: Tin; Contact Finish Thickness - Mating: 100.0µin (2.54µm); Contact Material: Brass; Contact Shape: Square; Contact Type: Male Pin; Fastening Type: Friction Lock; Insulation Color: Natural; Insulation Height: 0.461" (11.70mm); Insulation Material: Polyamide (PA), Nylon; LastUpdated: 1/12/2020 11:52:24 PM; Lifecycle Status: Active; Minimum Order: 1; Mounting Type: Through Hole; Number of Rows: 1; Packaging: Bulk; PartId: 80; Part Status: Active; Price: 0.49; Series: KK 6410; Supplier 1: DigiKey; Supplier Part Number 1: WM4115-ND; Termination: Solder
R10 R11 = LVT12R0100FER: RES 0.01 OHM 1% 1W 1206; Manufacturer: Ohmite; Temperature Coefficient: ±75ppm/°C; Part Number: LVT12R0100FER; ComponentLink1Description: Datasheet; ComponentLink1URL: https://www.ohmite.com/assets/docs/res_lvt.pdf?r=false; ComponentLink2Description: DigiKey Link; ComponentLink2URL: http://digikey.com/product-detail/en/ohmite/LVT12R0100FER/LVT12R0100FERCT-ND/9556182; Composition: Metal Element; Device Package: 1206 (3216 Metric); Features: Current Sense; Height - Seated (Max): 0.026" (0.65mm); LastUpdated: 9/2/2020 1:12:33 AM; Lifecycle Status: Active; Minimum Order: 1; Number of Terminations: 2; Operating Temperature: -55°C ~ 155°C; Package / Case: 1206 (3216 Metric); Packaging: TapeAndReel; PartId: 42343; Part Status: Active; Power (Watts): 1W; Price: 0.07; Resistance: 10 mOhms; Series: LVT; Size / Dimension: 0.126" L x 0.063" W (3.20mm x 1.60mm); Supplier 1: DigiKey; Supplier Part Number 1: LVT12R0100FERCT-ND; Supplier Device Package: 1206; Tolerance: ±1%; Value: 10 mOhms
R12 R13 = RN73R2ATTD1001F50: RES 1K OHM 1% 1/8W 0805; Manufacturer: KOA Speer Electronics, Inc.; Power (Watts): 0.125W, 1/8W; Temperature Coefficient: ±50ppm/°C; Part Number: RN73R2ATTD1001F50; Value: 1 kOhms; ComponentLink1Description: Datasheet; ComponentLink1URL: //media.digikey.com/pdf/Data%20Sheets/KOA%20Speer/RN73R_Type_DS.pdf; ComponentLink2Description: DigiKey Link; ComponentLink2URL: http://digikey.com/product-detail/en/koa-speer-electronics-inc/RN73R2ATTD1001F50/2019-RN73R2ATTD1001F50CT-ND/11476952; Composition: Metal Film; Device Package: 0805 (2012 Metric); Features: Moisture Resistant; LastUpdated: 9/2/2020 1:14:23 AM; Lifecycle Status: Active; Minimum Order: 1; Number of Terminations: 2; Operating Temperature: -55°C ~ 155°C; Package / Case: 0805 (2012 Metric); Packaging: TapeAndReel; PartId: 50101; Part Status: Active; Price: 0.06; Resistance: 1 kOhms; Series: RN73R; Supplier 1: DigiKey; Supplier Part Number 1: 2019-RN73R2ATTD1001F50CT-ND; Supplier Device Package: 0805; Tolerance: ±1%
R14 R15 = ERJ-6ENF5601V: RES SMD 5.6K OHM 1% 1/8W 0805; Manufacturer: Panasonic Electronic Components; Power (Watts): 0.125W, 1/8W; Temperature Coefficient: ±100ppm/°C; Part Number: ERJ-6ENF5601V; Value: 5.6 kOhms; ComponentLink1Description: Datasheet; ComponentLink1URL: https://industrial.panasonic.com/cdbs/www-data/pdf/RDA0000/AOA0000C304.pdf; ComponentLink2Description: DigiKey Link; ComponentLink2URL: http://digikey.com/product-detail/en/panasonic-electronic-components/ERJ-6ENF5601V/P5.60KCCT-ND/1746882; Composition: Thick Film; Device Package: 0805 (2012 Metric); Features: Automotive AEC-Q200; Height - Seated (Max): 0.028" (0.70mm); LastUpdated: 9/2/2020 1:15:09 AM; Lifecycle Status: Active; Minimum Order: 1; Number of Terminations: 2; Operating Temperature: -55°C ~ 155°C; Package / Case: 0805 (2012 Metric); Packaging: TapeAndReel; PartId: 34762; Part Status: Active; Price: 0.01; Ratings: AEC-Q200; Resistance: 5.6 kOhms; Series: ERJ; Size / Dimension: 0.079" L x 0.049" W (2.00mm x 1.25mm); Supplier 1: DigiKey; Supplier Part Number 1: P5.60KCCT-ND; Supplier Device Package: 0805; Tolerance: ±1%
R16 R17 = CRCW08051K00FKEA: RES SMD 1K OHM 1% 1/8W 0805; Manufacturer: Vishay Dale; Power (Watts): 0.125W, 1/8W; Temperature Coefficient: ±100ppm/°C; Part Number: CRCW08051K00FKEA; Value: 1 kOhms; ComponentLink1Description: Datasheet; ComponentLink1URL: http://www.vishay.com/docs/20035/dcrcwe3.pdf; ComponentLink2Description: DigiKey Link; ComponentLink2URL: http://digikey.com/product-detail/en/vishay-dale/CRCW08051K00FKEA/541-1.00KCCT-ND/1180783; Composition: Thick Film; Device Package: 0805 (2012 Metric); Features: Automotive AEC-Q200; Height - Seated (Max): 0.020" (0.50mm); LastUpdated: 9/2/2020 1:15:23 AM; Lifecycle Status: Active; Minimum Order: 1; Number of Terminations: 2; Operating Temperature: -55°C ~ 155°C; Package / Case: 0805 (2012 Metric); Packaging: TapeAndReel; PartId: 28103; Part Status: Active; Price: 0.01; Ratings: AEC-Q200; Resistance: 1 kOhms; Series: CRCW; Size / Dimension: 0.079" L x 0.049" W (2.00mm x 1.25mm); Supplier 1: DigiKey; Supplier Part Number 1: 541-1.00KCCT-ND; Supplier Device Package: 0805; Tolerance: ±1%